# EAGLE design nanoController (EAGLE 9.6.1)
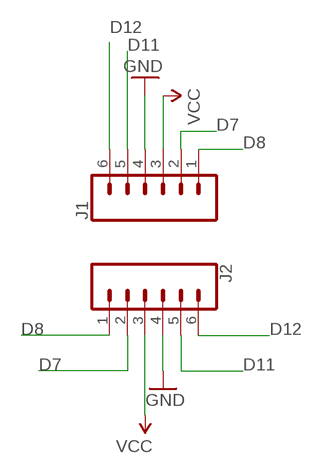
[diagram p0: schematic, sheet 1]

## Parts
J1  CONN_06SILK_FEMALE_PTH  [1X06]
J2  CONN_06SILK_FEMALE_PTH  [1X06]

## Nets
D7: J1.2 J2.2
D8: J1.1 J2.1
D11: J1.5 J2.5
D12: J1.6 J2.6
GND [gnd]: J1.4 J2.4
VCC: J1.3 J2.3

## Library data of the parts
J1 J2 = SparkFun-Connectors:CONN_06: Multi connection point. Often used as Generic Header-pin footprint for 0.1 inch spaced/style header connections On any of the 0.1 inch spaced packages, you can populate with these: Break Away Headers - Straight <https://www.sparkfun.com/products/116> (PRT-00116) Break Away Male Headers - Right Angle <https://www.sparkfun.com/products/553> (PRT-00553) Female Headers <https://www.sparkfun.com/products/115> (PRT-00115) Break Away Headers - Machine Pin <https://www.sparkfun.com/products/117> (PRT-00117) Break Away Female Headers - Swiss Machine Pin <https://www.sparkfun.com/products/743> (PRT-00743) Arduino Stackable Header - 6 Pin <https://www.sparkfun.com/products/9280> (PRT-09280) For SCREWTERMINALS and SPRING TERMINALS visit here: Screw Terimnals on SparkFun.com <https://www.sparkfun.com/search/results?term=Screw+Terminals> (5mm/3.5mm/2.54mm spacing) This device is also useful as a general connection point to wire up your design to another part of your project. Our various solder wires solder well into these plated through hole pads. Hook-Up Wire - Assortment (Stranded, 22 AWG) <https://www.sparkfun.com/products/11375> (PRT-11375) Hook-Up Wire - Assortment (Solid Core, 22 AWG) <https://www.sparkfun.com/products/11367> (PRT-11367) View the entire wire category on our website here <https://www.sparkfun.com/categories/141>; PROD_ID: CONN-08437

## Net classes
0 default: width 0.254 mm, clearance 0.254 mm
1 power: width 0.61 mm, drill 0.711 mm, clearance 0.33 mm
2 gnd: width 0.305 mm, drill 0.711 mm, clearance 0.254 mm
3 usbvcc: width 0.508 mm, drill 0.711 mm, clearance 0.254 mm
4 aref: width 0.406 mm

## Board
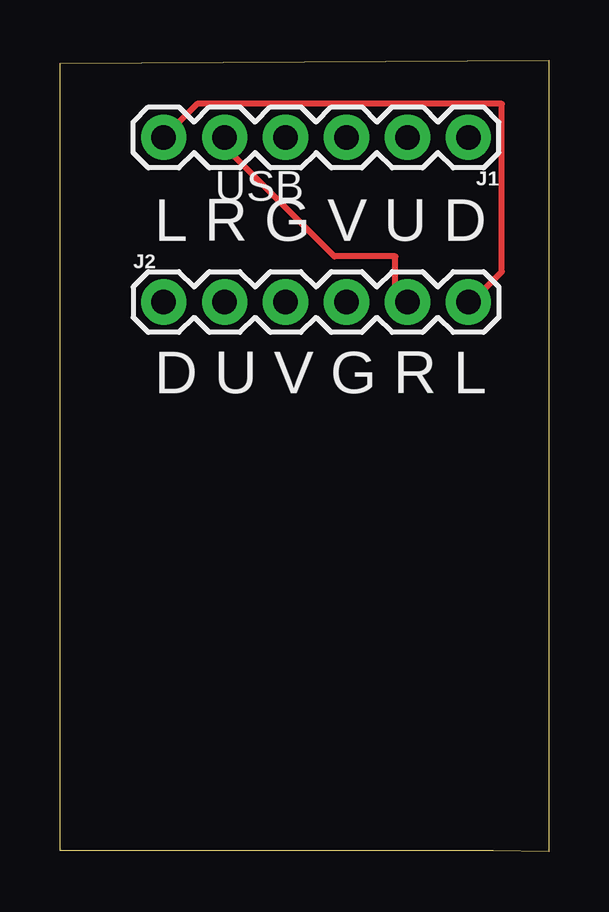
[diagram p1: board, top side]
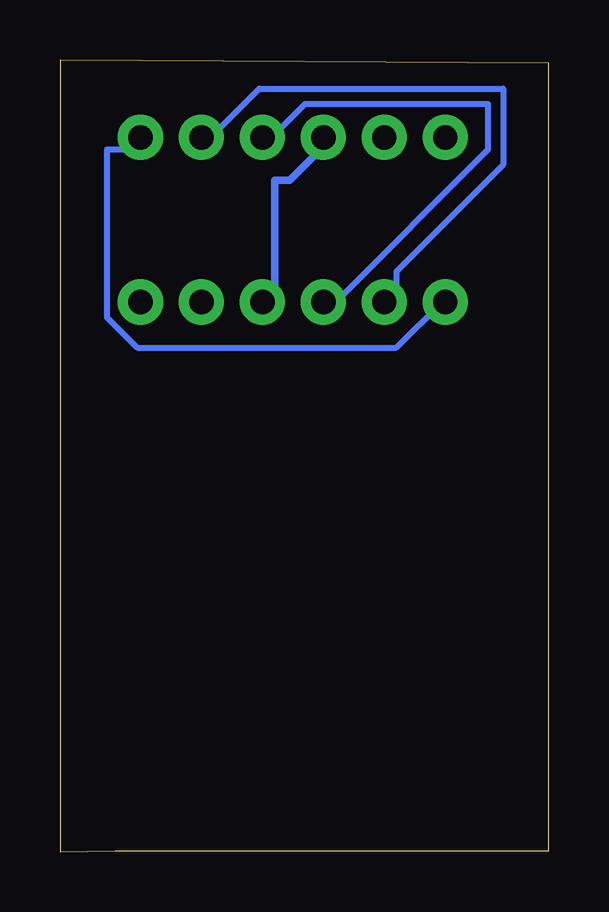
[diagram p2: board, bottom side, seen from below]

Size 20.37 x 32.99 mm. Coordinates in mm from the lower left corner, seen from the top.
Outline: 0,32.87 20.37,32.99 20.37,0 18.06,0.05 0,0.05 0,32.87
Copper layers (1*16): Top 0.035mm / dielectric 1.5mm / Bottom 0.035mm
Design rules "default": minimum track width 10mil, minimum drill 22mil, track to track 10mil, track to pad 10mil, pad to pad 10mil, via to via 16mil, smd to smd 8mil, copper to edge 30mil, drill to drill 12mil, minimum pad ring 10mil, minimum via ring 10mil, stop-mask expansion 4mil, vias tented up to drill 0mil, thermal gap 10mil
vRestrict: area 25.4,45.5 to 27.1,49.2; area 33.4,41.1 to 34.9,44.6; area 35.9,41.1 to 37.5,44.6; area 38.5,41.1 to 40,44.6; area 42.5,38.7 to 43.1,38.9

### Footprints (pad centres in the part's own frame; a part is rotated, then mirrored left to right if it is on the bottom)
1X06 = drill 1.016 pad 1.88: 1 0,0; 2 2.54,0; 3 5.08,0; 4 7.62,0; 5 10.16,0; 6 12.7,0

### Placement (x,y rotation side)
J1  17.02,29.77 180 top
J2  4.32,22.91 0 top

### Tracks (layer width: path | path; a pad name or v marks a point on that pad's centre or on a via)
D7
  Bottom 0.254: J2.2 6.35,22.91 6.35,24.18 1.91,28.63 1.91,31.8 12.06,31.8 13.97,29.9 J1.2
D8
  Bottom 0.254: J2.1 4.45,22.91 6.35,21.01 17.14,21.01 18.41,22.28 18.41,29.26 17.14,29.26 J1.1
D11
  Top 0.254: J1.5 6.99,29.26 11.43,24.82 13.97,24.82 13.97,22.91 J2.5
D12
  Top 0.254: J1.6 5.71,31.17 18.41,31.17 18.41,24.18 17.14,22.91 J2.6
GND
  Bottom 0.305: J2.4 11.43,22.91 11.43,27.99 10.79,27.99 9.53,29.26 J1.4
VCC
  Bottom 0.254: J2.3 8.89,22.91 2.54,29.26 2.54,31.17 10.16,31.17 11.43,29.9 J1.3

### Text on the board
tNames: 3 2 1 0 9 8 | GND | 1 1 1 1 | AREF | PWM | PWM | PWM | USB
Reference: C8 | C2 | R11 | C4 | C5
_tsilk: L R G V U D | D U V G R L